# EAGLE design ArduinoShield (EAGLE 7.4.0)
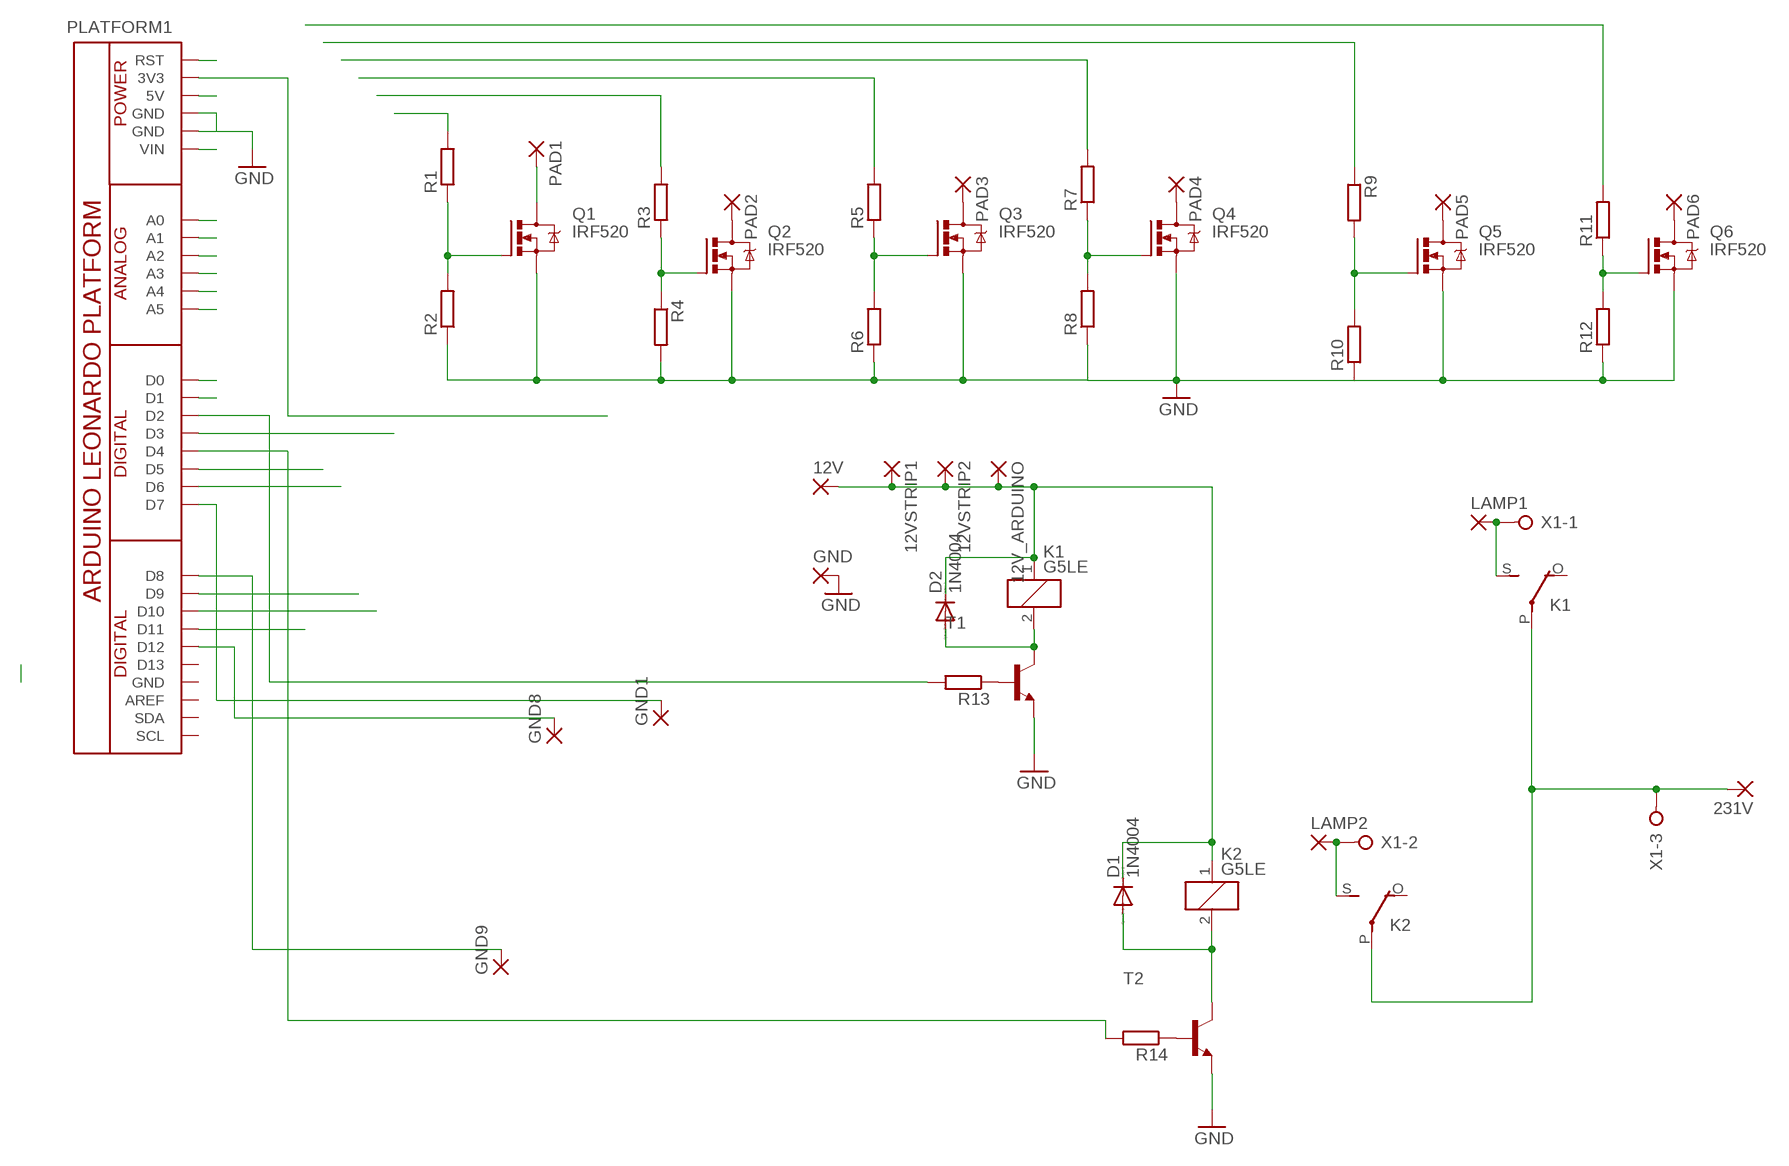
[diagram p0: schematic, sheet 1]

## Parts
12V  WIREPAD1,6/0,8  [1,6/0,8]
12V_ARDUINO  WIREPAD1,6/0,8  [1,6/0,8]
12VSTRIP1  WIREPAD1,6/0,8  [1,6/0,8]
12VSTRIP2  WIREPAD1,6/0,8  [1,6/0,8]
231V  WIREPAD1,6/0,8  [1,6/0,8]
D1  1N4004  [DO41-10]
D2  1N4004  [DO41-10]
GND  WIREPAD1,6/0,8  [1,6/0,8]
GND1  WIREPAD1,6/0,8  [1,6/0,8]
GND8  WIREPAD1,6/0,8  [1,6/0,8]
GND9  WIREPAD1,6/0,8  [1,6/0,8]
K1  G5LE  [G5LE]
K2  G5LE  [G5LE]
LAMP1  WIREPAD1,6/0,8  [1,6/0,8]
LAMP2  WIREPAD1,6/0,8  [1,6/0,8]
PAD1  WIREPAD1,6/0,8  [1,6/0,8]
PAD2  WIREPAD1,6/0,8  [1,6/0,8]
PAD3  WIREPAD1,6/0,8  [1,6/0,8]
PAD4  WIREPAD1,6/0,8  [1,6/0,8]
PAD5  WIREPAD1,6/0,8  [1,6/0,8]
PAD6  WIREPAD1,6/0,8  [1,6/0,8]
PLATFORM1  1xPN1x10+1xPN1x8+2xPN1x6  ARDUINO_LEONARDO  [ARDUINO-LEONARDO-PLATFORM]
Q1  IRF520  [TO220BV]
Q2  IRF520  [TO220BV]
Q3  IRF520  [TO220BV]
Q4  IRF520  [TO220BV]
Q5  IRF520  [TO220BV]
Q6  IRF520  [TO220BV]
R1  R-EU_0207/7  [0207/7]
R2  R-EU_0207/7  [0207/7]
R3  R-EU_0207/7  [0207/7]
R4  R-EU_0207/7  [0207/7]
R5  R-EU_0207/7  [0207/7]
R6  R-EU_0207/7  [0207/7]
R7  R-EU_0207/7  [0207/7]
R8  R-EU_0207/7  [0207/7]
R9  R-EU_0207/7  [0207/7]
R10  R-EU_0207/7  [0207/7]
R11  R-EU_0207/7  [0207/7]
R12  R-EU_0207/7  [0207/7]
R13  R-EU_0207/7  [0207/7]
R14  R-EU_0207/7  [0207/7]
T1  BC547-NPN-TO92-CBE  [TO92-CBE]
T2  BC547-NPN-TO92-CBE  [TO92-CBE]
X1  W237-3E  [W237-3E]

## Nets
GND: GND.1(P) PLATFORM1.GND PLATFORM1.GND@1(GND) Q1.S Q2.S Q3.S Q4.S Q5.S Q6.S R2.1 R4.2 R6.1 R8.1 R10.1 R12.1 T1.E T2.E
N$1: Q5.G R9.2 R10.2
N$2: Q6.G R11.1 R12.2
N$3: Q4.G R7.1 R8.2
N$4: Q3.G R5.1 R6.2
N$5: Q2.G R3.1 R4.1
N$6: Q1.G R1.1 R2.2
N$7: PAD1.1(P) Q1.D
N$8: PAD2.1(P) Q2.D
N$9: PAD3.1(P) Q3.D
N$10: PAD4.1(P) Q4.D
N$11: PAD5.1(P) Q5.D
N$12: PAD6.1(P) Q6.D
N$13: R11.2
N$14: PLATFORM1.D5 R3.2
N$15: PLATFORM1.D6 R5.2
N$16: R7.2
N$17: R9.1
N$18: PLATFORM1.D11
N$19: D1.A K2.2 T2.C
N$20: PLATFORM1.D2 R13.2
N$21: 12V.1(P) 12V_ARDUINO.1(P) 12VSTRIP1.1(P) 12VSTRIP2.1(P) D1.C D2.C K1.1 K2.1
N$22: D2.A K1.2 T1.C
N$23: R13.1 T1.B
N$24: R14.1 T2.B
N$25: PLATFORM1.D4 R14.2
N$27: K2.S(2:S) LAMP2.1(P) X1.2
N$28: K1.S(2:S) LAMP1.1(P) X1.1
N$29: GND9.1(P) PLATFORM1.D8
N$30: GND8.1(P) PLATFORM1.D12
N$31: GND1.1(P) PLATFORM1.D7
N$32: PLATFORM1.3V3
N$34: PLATFORM1.A0
N$36: PLATFORM1.A1
N$37: 231V.1(P) K1.P(2:P) K2.P(2:P) X1.3
N$39: PLATFORM1.A2
N$40: PLATFORM1.A3
N$41: PLATFORM1.A4
N$42: PLATFORM1.A5
N$43: PLATFORM1.D9
N$44: PLATFORM1.D10
N$45: PLATFORM1.D3 R1.2
N$46: PLATFORM1.VIN
N$49: PLATFORM1.5V
N$51: PLATFORM1.RST
N$62: PLATFORM1.D0
N$63: PLATFORM1.D1
Unconnected: K1.O(2:O) K2.O(2:O) PLATFORM1.AREF PLATFORM1.D13 PLATFORM1.GND@2(GND) PLATFORM1.SCL PLATFORM1.SDA

## Library data of the parts
12V 12V_ARDUINO 12VSTRIP1 12VSTRIP2 231V GND GND1 GND8 GND9 LAMP1 LAMP2 PAD1-PAD6 = wirepad:WIREPAD: Wire PAD connect wire on PCB
D1 D2 = diode:1N4004: DIODE general purpose rectifier, 1 A
K1 K2 = relay:G5LE: RELAY 1 x switch, 10 A/120 V AC, 8 A/30 V DC, Omron; OC_FARNELL: unknown; OC_NEWARK: unknown
PLATFORM1 = OLIMEX_CASES:ARDUINO_LEONARDO
Q1-Q6 = transistor-power:IRF520: HEXFET Power MOSFET
R1-R14 = resistor:R-EU_: RESISTOR, European symbol
T1 T2 = transistor:*-NPN-: NPN Transistror BF959 corrected 2008.03.06
X1 = con-wago-508:W237-3E: WAGO SREW CLAMP; OC_FARNELL: unknown; OC_NEWARK: unknown

## Net classes
1 pwr: width 0.25 mm

## Board
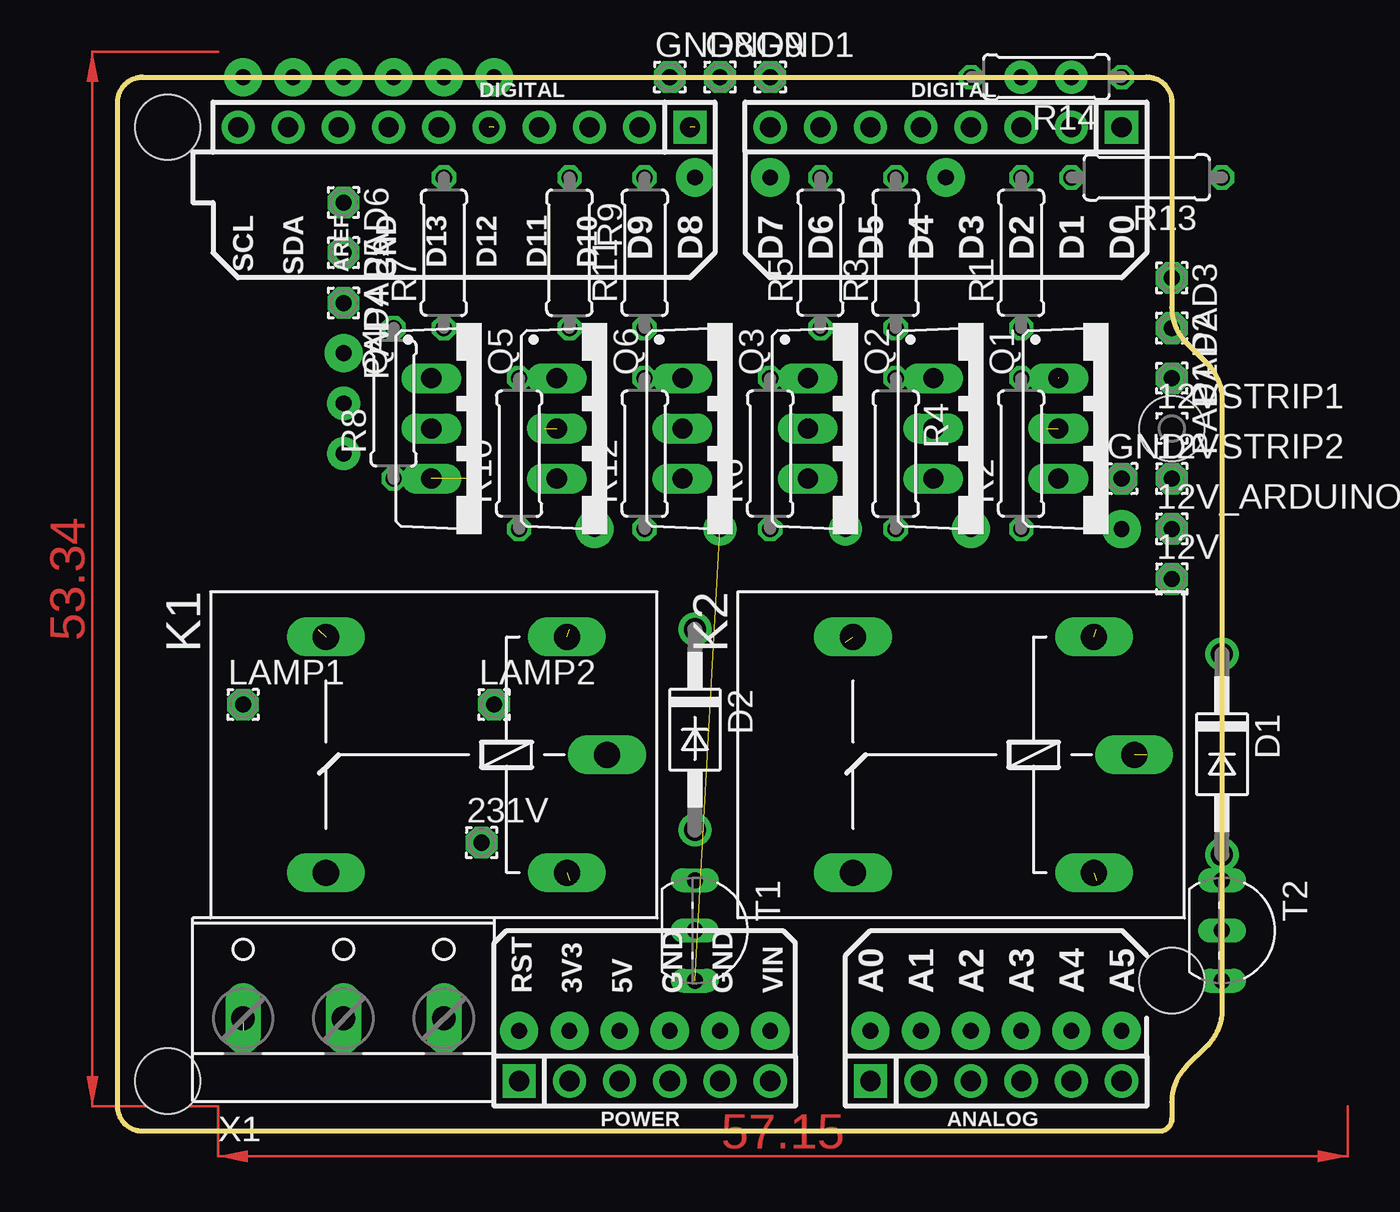
[diagram p1: board, top side]
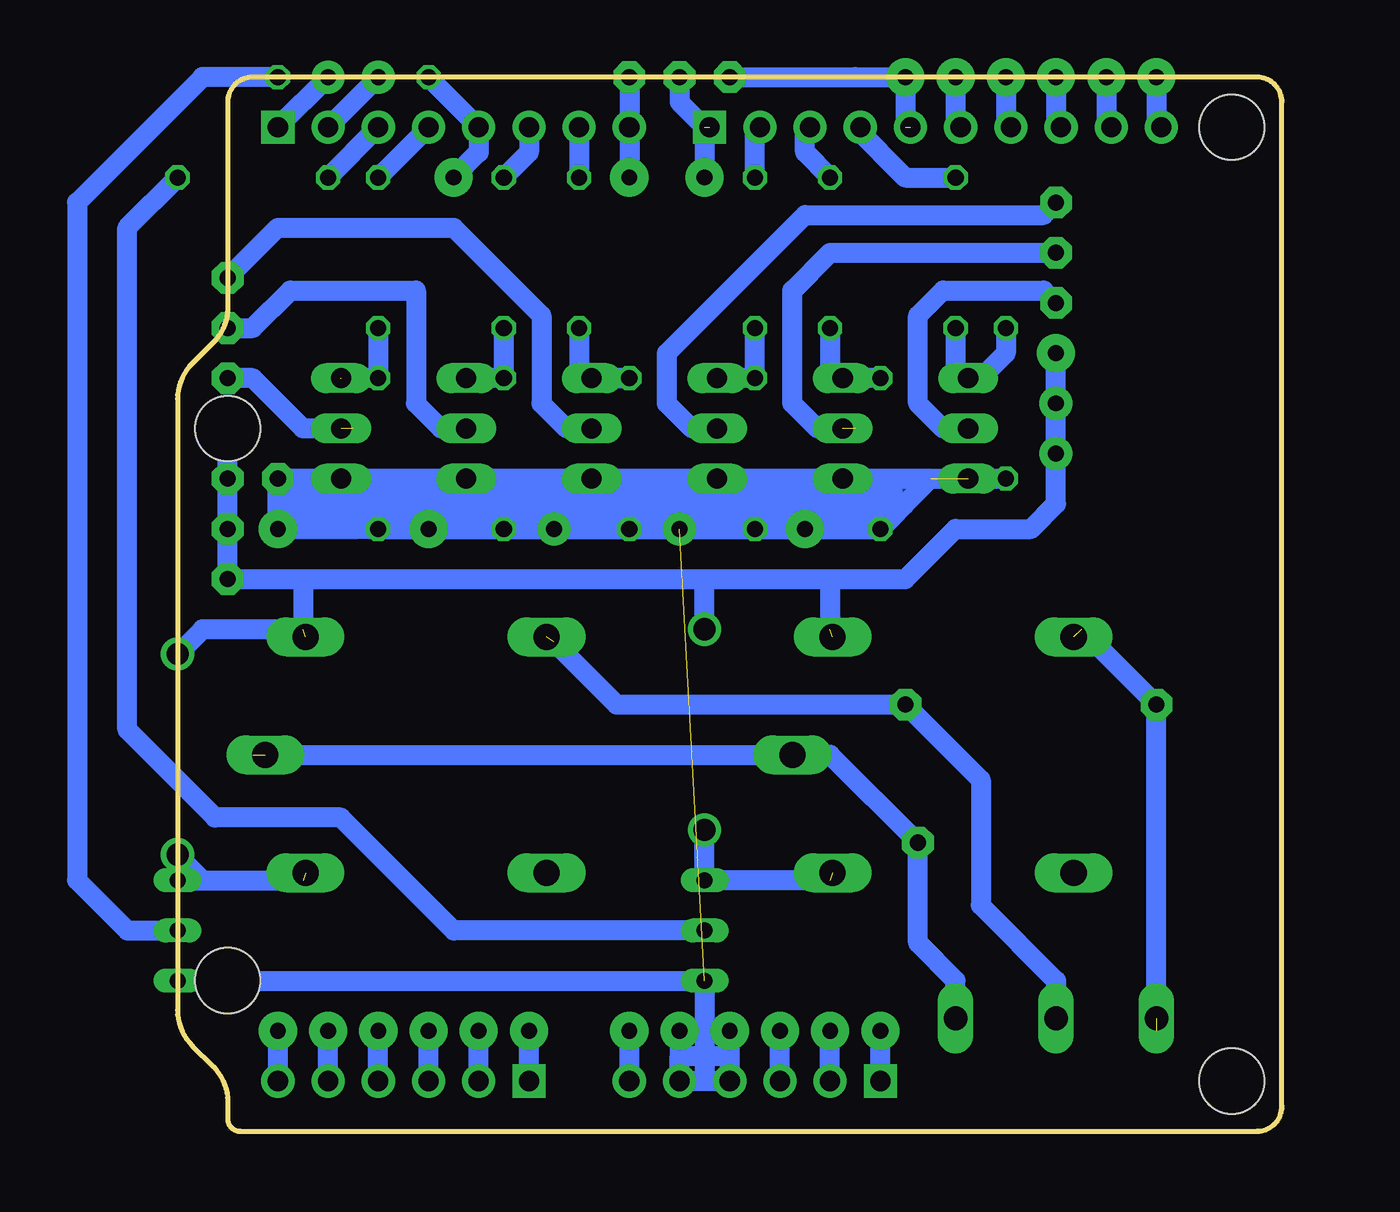
[diagram p2: board, bottom side, seen from below]

Size 55.88 x 53.34 mm. Coordinates in mm from the lower left corner, seen from the top.
Copper layers (1+16): Top 0.035mm / dielectric 1.5mm / Bottom 0.035mm
Design rules "default": minimum track width 10mil, minimum drill 0.6mm, track to track 0.2mm, track to pad 0.2mm, pad to pad 0.2mm, via to via 0.2mm, smd to smd 1mil, copper to edge 10mil, drill to drill 8mil, minimum pad ring 8mil, minimum via ring 0.2mm, stop-mask expansion 4mil, vias tented up to drill 25mil, thermal gap 20mil

### Footprints (pad centres in the part's own frame; a part is rotated, then mirrored left to right if it is on the bottom)
1,6/0,8 = drill 0.813 pad 1.6 octagon: 1 0,0
DO41-10 = drill 1.118: A 5.08,0; C -5.08,0
G5LE = drill 1.321 long: 1 -7.493,-5.969; 2 -7.493,5.969; O 4.699,5.969; P -9.525,0; S 4.699,-5.969
ARDUINO-LEONARDO-PLATFORM = drill 1.016 pad 1.676: 3V3 22.86,2.54; 5V 25.4,2.54; A1 40.64,2.54; A2 43.18,2.54; A3 45.72,2.54; A4 48.26,2.54; A5 50.8,2.54; AREF 11.176,50.8; D1 48.26,50.8; D2 45.72,50.8; D3 43.18,50.8; D4 40.64,50.8; D5 38.1,50.8; D6 35.56,50.8; D7 33.02,50.8; D9 26.416,50.8; D10 23.876,50.8; D11 21.336,50.8; D12 18.796,50.8; D13 16.256,50.8; GND 27.94,2.54; GND@1 30.48,2.54; GND@2 13.716,50.8; SCL 6.096,50.8; SDA 8.636,50.8; VIN 33.02,2.54 | drill 1.016 pad 1.676 square: A0 38.1,2.54; D0 50.8,50.8; D8 28.956,50.8; RST 20.32,2.54 | hole 3.3: 53.34,35.56; 53.34,7.62; 2.54,50.8; 2.54,2.54
TO220BV = drill 1.016 long: D 0,-2.54; G -2.54,-2.54; S 2.54,-2.54
0207/7 = drill 0.813 octagon: 1 -3.81,0; 2 3.81,0
TO92-CBE = drill 0.813 long: B 0,0; C -2.54,0; E 2.54,0
W237-3E = drill 1.194 long: 1 -5.08,-0.635; 2 0,-0.635; 3 5.08,-0.635

### Placement (x,y rotation side)
12V  53.34,27.94 0 top
12V_ARDUINO  53.34,30.48 0 top
12VSTRIP1  53.34,35.56 0 top
12VSTRIP2  53.34,33.02 0 top
231V  18.41,14.61 0 top
D1  55.88,19.08 270 top
D2  29.21,20.32 270 top
GND  50.8,33.02 0 top
GND1  33.02,53.34 0 top
GND8  27.94,53.34 0 top
GND9  30.48,53.34 0 top
K1  15.24,19.05 180 top
K2  41.91,19.05 180 top
LAMP1  6.35,21.59 0 top
LAMP2  19.05,21.59 0 top
PAD1  53.34,38.1 270 top
PAD2  53.34,40.64 270 top
PAD3  53.34,43.18 270 top
PAD4  11.43,41.91 270 top
PAD5  11.43,44.45 270 top
PAD6  11.43,46.99 270 top
PLATFORM1  0,0 0 top
Q1  50.14,35.56 270 top
Q2  43.81,35.56 270 top
Q3  37.47,35.56 270 top
Q4  18.41,35.56 270 top
Q5  24.77,35.56 270 top
Q6  31.11,35.56 270 top
R1  45.72,44.45 90 top
R2  45.72,34.29 90 top
R3  39.37,44.45 90 top
R4  39.37,34.29 270 top
R5  35.56,44.45 90 top
R6  33.02,34.29 90 top
R7  16.51,44.45 90 top
R8  13.97,36.83 90 top
R9  22.86,44.45 270 top
R10  20.32,34.29 90 top
R11  26.67,44.45 90 top
R12  26.67,34.29 90 top
R13  52.07,48.26 180 top
R14  46.99,53.34 180 top
T1  29.21,10.16 270 top
T2  55.88,10.16 270 top
X1  11.43,6.35 0 top

### Tracks (layer width: path | path; a pad name or v marks a point on that pad's centre or on a via)
GND  (via drill 0.8 pad 1.68, 0.8 pad 1.93)  (2 unrouted)
  Bottom 1.016: 46.99,33.02 40.64,33.02 | 40.64,33.02 34.29,33.02 | 34.29,33.02 27.94,33.02 | 27.94,33.02 21.59,33.02 | 21.59,33.02 17.78,33.02 | 17.78,33.02 R8.1 | R10.1 21.59,31.75 21.59,33.02 | R12.1 27.94,31.75 27.94,33.02 | R6.1 34.29,31.75 34.29,33.02 | R4.2 40.64,31.75 40.64,33.02 | R2.1 46.99,31.75 46.99,33.02 | T2.E T1.E 29.21,5.08 | 29.21,5.08 29.21,2.54 PLATFORM1.GND@1 | 46.99,33.02 GND.1 50.8,32.38 | 29.21,5.08 v27.94,5.08 27.94,3.81 | 29.21,5.08 v30.48,5.08 30.48,3.81 | R2.1 v50.8,30.48 50.8,31.11 | 50.8,31.11 50.8,31.75 | 50.8,31.75 50.8,32.38 | R2.1 v43.18,30.48 v36.83,30.48 v30.48,30.48 v24.13,30.48 R10.1 | R10.1 19.05,31.75 | 19.05,31.75 17.78,33.02 | 27.94,3.81 PLATFORM1.GND PLATFORM1.GND@1 | PLATFORM1.GND@1 30.48,3.81 | 30.48,3.81 27.94,3.81 | 19.05,31.75 50.8,31.75 | 20.32,31.11 50.8,31.11 | 50.8,32.38 19.68,32.38
  pour Bottom: 17.78,33.02 50.8,33.02 50.8,30.48 20.32,30.48
N$1
  Bottom 1.016: R10.2 21.59,38.1 Q5.G 22.86,38.1 R9.2
N$2
  Bottom 1.016: Q6.G R12.2 R11.1
N$3
  Bottom 1.016: R8.2 13.97,39.37 15.24,38.1 Q4.G 16.51,38.1 R7.1
N$4
  Bottom 1.016: Q3.G R6.2 35.56,38.1 R5.1
N$5
  Bottom 1.016: Q2.G R4.1 R3.1
N$6  (1 unrouted)
  Bottom 1.016: 47.62,38.1 R2.2 R1.1
N$7  (1 unrouted)
  Bottom 1.016: 46.99,35.56 49.53,35.56 52.07,38.1 PAD1.1
N$8
  Bottom 1.016: PAD2.1 52.07,40.64 50.16,42.55 43.81,42.55 43.81,36.83 42.55,35.56 Q2.D
N$9
  Bottom 1.016: PAD3.1 50.8,45.72 41.91,45.72 37.47,41.27 37.47,36.83 36.2,35.56 Q3.D
N$10
  Bottom 1.016: Q4.D 17.14,35.56 18.41,36.83 18.41,41.27 17.14,42.55 12.06,42.55 PAD4.1
N$11  (1 unrouted)
  Bottom 1.016: 21.59,35.56 23.5,35.56 24.77,36.83 24.77,42.55 22.86,44.45 PAD5.1
N$12
  Bottom 1.016: Q6.D 29.84,35.56 31.11,36.83 31.11,39.37 24.13,46.35 12.06,46.35 PAD6.1
N$13
  Bottom 1.016: R11.2 26.67,50.8
N$14
  Bottom 1.016: PLATFORM1.D5 38.1,49.53 R3.2
N$15
  Bottom 1.016: PLATFORM1.D6 R5.2
N$16
  Bottom 1.016: 21.59,50.8 19.05,48.26 R7.2
N$17
  Bottom 1.016: R9.1 24.13,49.53 24.13,50.8
N$19  (2 unrouted)
  Bottom 1.016: 55.88,13.97 54.61,12.7 | 54.61,12.7 49.53,12.7 | T2.C 54.61,12.7
N$20
  Bottom 1.016: PLATFORM1.D2 R13.2
N$21  (via drill 0.8 pad 1.68, 0.8 pad 1.93)  (3 unrouted)
  Bottom 1.016: 49.53,27.94 29.21,27.94 | 29.21,27.94 22.86,27.94 | 22.86,27.94 22.86,25.4 | D2.C 29.21,27.94 | 49.53,27.94 12V.1 12V_ARDUINO.1 12VSTRIP2.1 12VSTRIP1.1 | 49.53,27.94 49.53,25.4 54.61,25.4 55.88,24.13 | 22.86,27.94 19.05,27.94 16.51,30.48 12.7,30.48 11.43,31.75 v11.43,34.29 v11.43,36.83 v11.43,39.37
N$22  (1 unrouted)
  Bottom 1.016: 22.86,12.7 26.67,12.7 T1.C D2.A
N$23
  Bottom 1.016: T1.B 41.91,10.16 47.62,15.88 53.98,15.88 58.42,20.32 58.42,45.72 R13.1
N$24
  Bottom 1.016: R14.1 54.61,53.34 60.96,46.99 60.96,12.7 58.42,10.16 T2.B
N$25  (via drill 0.8 pad 1.93)
  Bottom 1.016: R14.2 PLATFORM1.D4 40.64,49.53 v41.91,48.26
N$27  (1 unrouted)
  Bottom 1.016: 36.83,24.77 33.66,21.59 LAMP2.1 15.24,17.78 15.24,11.43 11.43,7.62 X1.2
N$28  (2 unrouted)
  Bottom 1.016: 6.35,5.08 LAMP1.1 10.16,25.4
N$29  (via drill 0.8 pad 1.93)  (1 unrouted)
  Bottom 1.016: GND9.1 30.48,52.07 29.21,50.8 v29.21,48.26
N$30  (via drill 0.8 pad 1.93)  (1 unrouted)
  Bottom 1.016: GND8.1 21.59,53.34 v19.05,53.34 19.05,50.8
N$31  (via drill 0.8 pad 1.93)
  Bottom 1.016: v33.02,48.26 PLATFORM1.D7 GND1.1
N$32  (via drill 0.8 pad 1.93)
  Bottom 1.016: PLATFORM1.3V3 v22.86,5.08
N$34  (via drill 0.8 pad 1.93)
  Bottom 1.016: PLATFORM1.A0 v38.1,5.08
N$36  (via drill 0.8 pad 1.93)
  Bottom 1.016: PLATFORM1.A1 v40.64,5.08
N$37  (1 unrouted)
  Bottom 1.016: 52.07,19.05 K1.P 22.86,19.05 231V.1 18.41,9.53 16.51,7.62 X1.3
N$39  (via drill 0.8 pad 1.93)
  Bottom 1.016: PLATFORM1.A2 v43.18,5.08
N$40  (via drill 0.8 pad 1.93)
  Bottom 1.016: PLATFORM1.A3 v45.72,5.08
N$41  (via drill 0.8 pad 1.93)
  Bottom 1.016: PLATFORM1.A4 v48.26,5.08
N$42  (via drill 0.8 pad 1.93)
  Bottom 1.016: v50.8,5.08 PLATFORM1.A5
N$45
  Bottom 1.016: PLATFORM1.D3 R1.2
N$46  (via drill 0.8 pad 1.93)
  Bottom 1.016: PLATFORM1.VIN v33.02,5.08
N$49  (via drill 0.8 pad 1.93)
  Bottom 1.016: PLATFORM1.5V v25.4,5.08
N$51  (via drill 0.8 pad 1.93)
  Bottom 1.016: PLATFORM1.RST v20.32,5.08
N$56  (via drill 0.8 pad 1.93)
  Bottom 1.016: v6.35,53.34 6.35,50.8
N$57  (via drill 0.8 pad 1.93)
  Bottom 1.016: v8.89,53.34 8.89,50.8
N$58  (via drill 0.8 pad 1.93)
  Bottom 1.016: v11.43,53.34 11.43,50.8
N$59  (via drill 0.8 pad 1.93)
  Bottom 1.016: v13.97,53.34 13.97,50.8
N$60  (via drill 0.8 pad 1.93)
  Bottom 1.016: v16.51,53.34 16.51,50.8
N$62  (via drill 0.8 pad 1.68)
  Bottom 1.016: PLATFORM1.D0 v48.26,53.34
N$63  (via drill 0.8 pad 1.68)
  Bottom 1.016: PLATFORM1.D1 v45.72,53.34
(copper drawn outside any net)
  shapes: Top area x2